# EAGLE design GasAlarm (EAGLE 8.4.0)
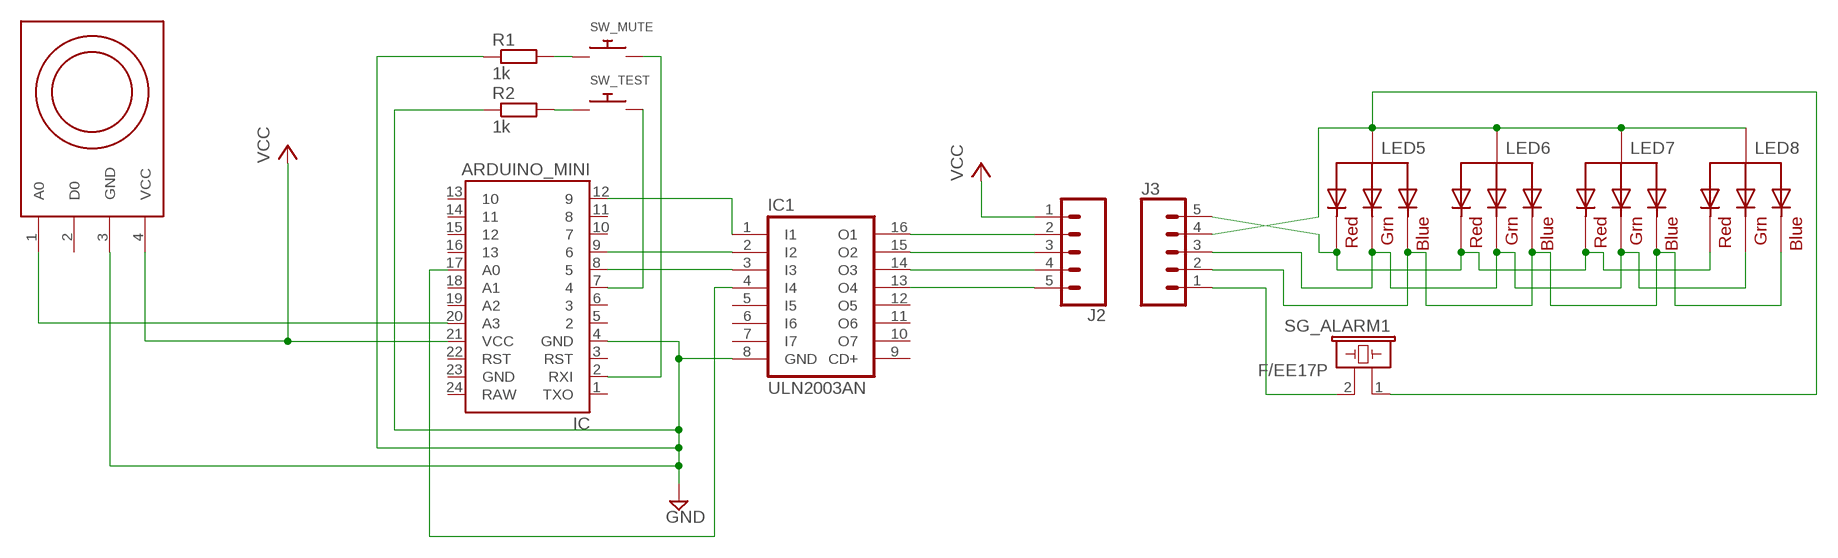
[diagram p0: schematic, sheet 1]

## Parts
IC  ARDUINO_MINI  [ARDUINO_MINI]
IC1  ULN2003AN  [DIL16]
J2  CONN_05  [1X05]
J3  CONN_05  [1X05]
LED5  RGBLED_CA-5MM  [LED5MMRGB]
LED6  RGBLED_CA-5MM  [LED5MMRGB]
LED7  RGBLED_CA-5MM  [LED5MMRGB]
LED8  RGBLED_CA-5MM  [LED5MMRGB]
MQ6  MQ-6  [DIP4-MQ_6]
R1  1k  R-EU_0204/5  [0204/5]
R2  1k  R-EU_0204/5  [0204/5]
SG_ALARM1  F/EE17P  [F/EE17P]
SW_MUTE  SWITCH_PUSHBUTTONSOFTTOUCHSMD_SJ  [PUSHBUTTON_SMD_SJ]
SW_TEST  SWITCH_PUSHBUTTONSOFTTOUCHSMD_SJ  [PUSHBUTTON_SMD_SJ]

## Nets
GND: IC1.8(GND) IC.4(GND) MQ6.3(GND) R1.1 R2.1
N$1: IC1.16(O1) J2.2
N$2: IC1.15(O2) J2.3
N$3: IC1.14(O3) J2.4
N$4: IC1.13(O4) J2.5
N$5: IC.7 SW_TEST.P$2
N$6: IC1.3(I3) IC.8
N$7: IC1.2(I2) IC.9
N$8: IC1.1(I1) IC.12
N$9: IC.2(RXI) SW_MUTE.P$2
N$10: R2.2 SW_TEST.P$1
N$11: R1.2 SW_MUTE.P$1
N$12: IC.20(A3) MQ6.1(A0)
N$14: IC1.4(I4) IC.17(A0)
N$19: J3.5 LED5.1(RED) LED6.1(RED) LED7.1(RED) LED8.1(RED)
N$20: J3.4 LED5.2(VCC) LED6.2(VCC) LED7.2(VCC) LED8.2(VCC) SG_ALARM1.1
N$21: J3.3 LED5.3(GREEN) LED6.3(GREEN) LED7.3(GREEN) LED8.3(GREEN)
N$22: J3.2 LED5.4(BLUE) LED6.4(BLUE) LED7.4(BLUE) LED8.4(BLUE)
N$23: J3.1 SG_ALARM1.2
VCC: IC.21(VCC) J2.1 MQ6.4(VCC)
Unconnected: IC1.5(I5) IC1.6(I6) IC1.7(I7) IC1.9(CD+) IC1.10(O7) IC1.11(O6) IC1.12(O5) IC.1(TXO) IC.3(RST) IC.5 IC.6 IC.10 IC.11 IC.13 IC.14 IC.15 IC.16 IC.18(A1) IC.19(A2) IC.22(RST) IC.23(GND) IC.24(RAW) MQ6.2(D0)

## Library data of the parts
IC = SparkFun-Retired:ARDUINO_MINI: Arduino Pro Mini footprint
IC1 = uln-udn:ULN2003A: DRIVER ARRAY
J2 J3 = SparkFun-Connectors:CONN_05: Multi connection point. Often used as Generic Header-pin footprint for 0.1 inch spaced/style header connections On any of the 0.1 inch spaced packages, you can populate with these: Break Away Headers - Straight <https://www.sparkfun.com/products/116> (PRT-00116) Break Away Male Headers - Right Angle <https://www.sparkfun.com/products/553> (PRT-00553) Female Headers <https://www.sparkfun.com/products/115> (PRT-00115) Break Away Headers - Machine Pin <https://www.sparkfun.com/products/117> (PRT-00117) Break Away Female Headers - Swiss Machine Pin <https://www.sparkfun.com/products/743> (PRT-00743) For SCREWTERMINALS and SPRING TERMINALS visit here: Screw Terimnals on SparkFun.com <https://www.sparkfun.com/search/results?term=Screw+Terminals> (5mm/3.5mm/2.54mm spacing) This device is also useful as a general connection point to wire up your design to another part of your project. Our various solder wires solder well into these plated through hole pads. Hook-Up Wire - Assortment (Stranded, 22 AWG) <https://www.sparkfun.com/products/11375> (PRT-11375) Hook-Up Wire - Assortment (Solid Core, 22 AWG) <https://www.sparkfun.com/products/11367> (PRT-11367) View the entire wire category on our website here <https://www.sparkfun.com/categories/141> Special notes: Molex polarized connector foot print use with SKU : PRT-08231 with associated crimp pins and housings. 1MM SMD Version SKU: PRT-10208
LED5-LED8 = adafruit:RGBLED_CA: RGB LED, common-anode 5MM Staggered pins 5mm Piranha package http://www.ladyada.net/library/pcb/eaglelibrary.html
MQ6 = GasAlarm:MQ-6
R1 R2 = resistor:R-EU_: RESISTOR, European symbol
SG_ALARM1 = buzzer:F/EE17P: BUZZER Source: Buerklin; OC_FARNELL: unknown; OC_NEWARK: unknown
SW_MUTE SW_TEST = adafruit:SWITCH_PUSHBUTTON: Buttons SOFTTOUCHSMD_SJ - Soft touch temporary push button (Super Junk Akihabara) Compatible with SKPMANE010 [Mouser: 688-SKPMAN] C&K_KSS = Digikey: KSS221GLFS

## Board
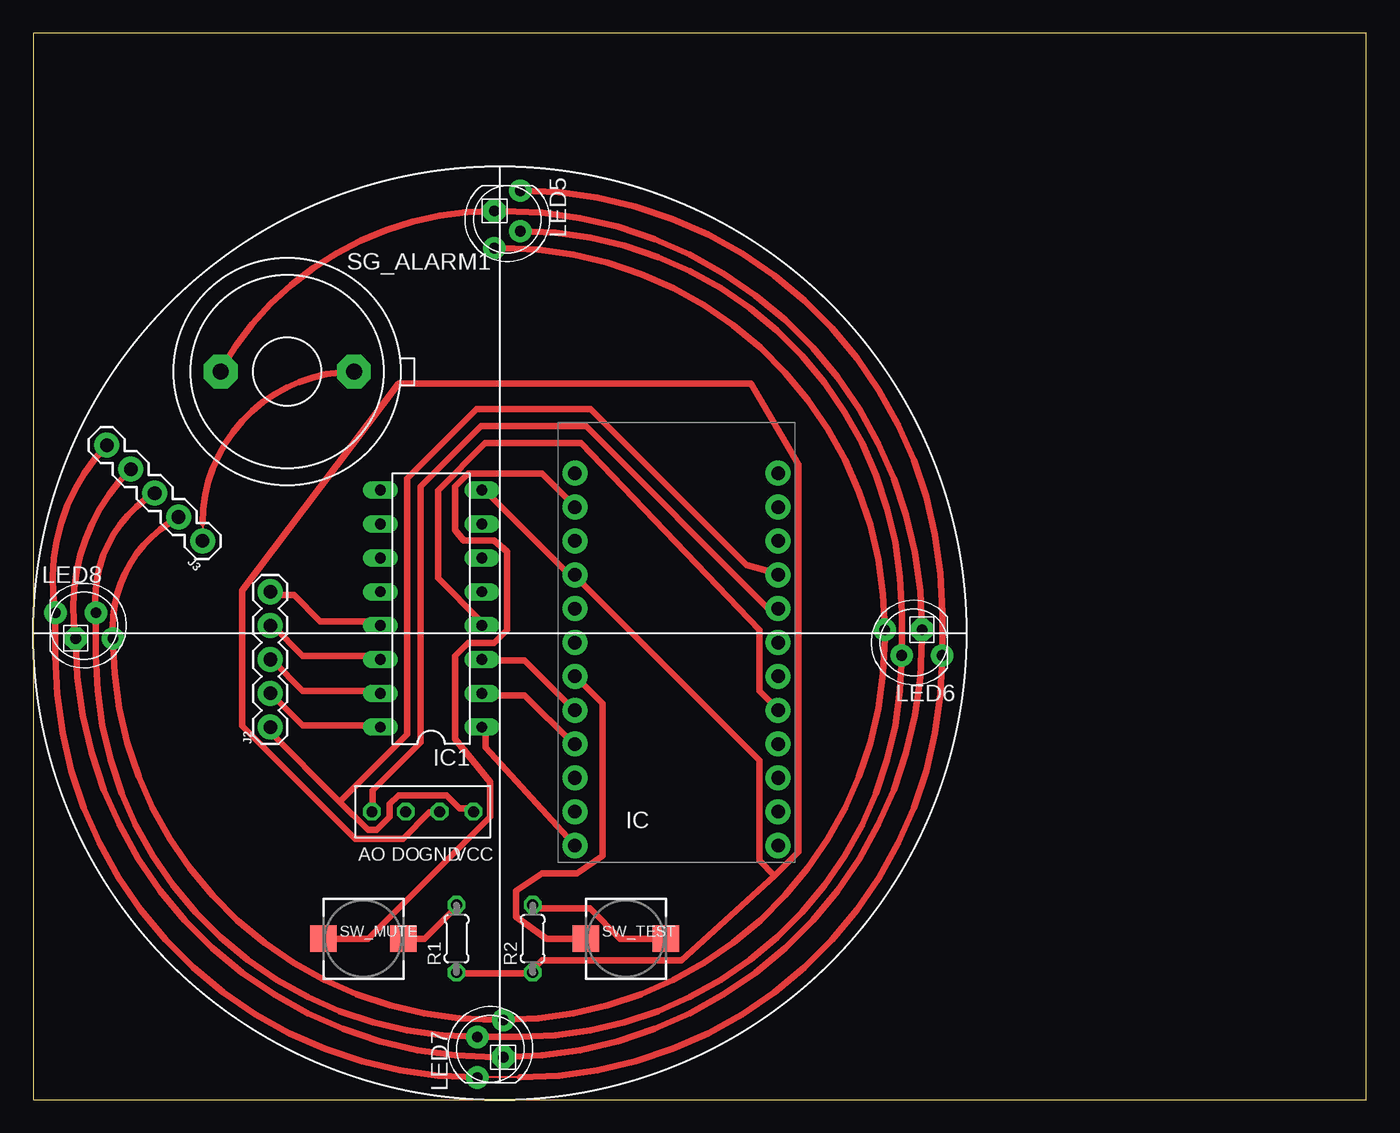
[diagram p1: board, top side]

Size 100 x 80 mm. Coordinates in mm from the lower left corner, seen from the top.
Outline: 0,0 100,0 100,80 0,80 0,0
Copper layers (1*16): Top 0.035mm / dielectric 1.5mm / Bottom 0.035mm
Design rules "default *": minimum track width 0.5mm, minimum drill 1mm, track to track 6mil, track to pad 6mil, pad to pad 6mil, via to via 6mil, smd to smd 6mil, copper to edge 40mil, drill to drill 6mil, minimum pad ring 10mil, minimum via ring 8mil, stop-mask expansion 4mil, vias tented up to drill 0mil, thermal gap 10mil

### Footprints (pad centres in the part's own frame; a part is rotated, then mirrored left to right if it is on the bottom)
ARDUINO_MINI = drill 1.016 pad 1.88: 1 -7.62,12.7; 2 -7.62,10.16; 3 -7.62,7.62; 4 -7.62,5.08; 5 -7.62,2.54; 6 -7.62,0; 7 -7.62,-2.54; 8 -7.62,-5.08; 9 -7.62,-7.62; 10 -7.62,-10.16; 11 -7.62,-12.7; 12 -7.62,-15.24; 13 7.62,-15.24; 14 7.62,-12.7; 15 7.62,-10.16; 16 7.62,-7.62; 17 7.62,-5.08; 18 7.62,-2.54; 19 7.62,0; 20 7.62,2.54; 21 7.62,5.08; 22 7.62,7.62; 23 7.62,10.16; 24 7.62,12.7
DIL16 = drill 0.813 long: 1 -8.89,-3.81; 2 -6.35,-3.81; 3 -3.81,-3.81; 4 -1.27,-3.81; 5 1.27,-3.81; 6 3.81,-3.81; 7 6.35,-3.81; 8 8.89,-3.81; 9 8.89,3.81; 10 6.35,3.81; 11 3.81,3.81; 12 1.27,3.81; 13 -1.27,3.81; 14 -3.81,3.81; 15 -6.35,3.81; 16 -8.89,3.81
1X05 = drill 1.016 pad 1.88: 1 0,0; 2 2.54,0; 3 5.08,0; 4 7.62,0; 5 10.16,0
LED5MMRGB = drill 0.8 pad 1.676: 1 -2.159,0.968; 3 0.889,0.968; 4 2.159,-0.968 | drill 0.8 pad 1.676 octagon: 2 -0.635,-0.968
DIP4-MQ_6 = drill 0.813 octagon: 1 -3.81,-0.635; 2 -1.27,-0.635; 3 1.27,-0.635; 4 3.81,-0.635
0204/5 = drill 0.813 octagon: 1 -2.54,0; 2 2.54,0
F/EE17P = drill 1.194 pad 2.54 octagon: 1 -5.004,0; 2 5.004,0
PUSHBUTTON_SMD_SJ = smd 2 x 2: P$1 3,0; P$2 -3,0

### Placement (x,y rotation side)
IC  48.26,34.29 0 top
IC1  29.84,36.83 90 top
J2  17.78,27.94 90 top
J3  12.7,41.91 135 top
LED5  35.56,66.04 270 top
LED6  66.04,34.29 180 top
LED7  34.29,3.81 90 top
LED8  3.81,35.56 0 top
MQ6  29.21,22.23 0 top
R1  31.75,12.06 90 top
R2  37.47,12.06 90 top
SG_ALARM1  19.05,54.61 0 top
SW_MUTE  24.77,12.06 0 top
SW_TEST  44.45,12.06 0 top

### Tracks (layer width: path | path; a pad name or v marks a point on that pad's centre or on a via)
GND
  Top 0.5: IC1.8 33.92,45.67 40.45,39.14 IC.4 40.77,39.14 54.48,25.44 54.48,17.94 55.62,16.8 | R1.1 31.97,9.46 37.19,9.46 R2.1 37.51,9.79 38.16,10.44 48.62,10.44 55.62,16.8 | 55.62,16.8 57.41,18.59 57.41,47.62 53.84,53.74 27.42,53.74 15.68,38.18 15.68,28.04 24.14,19.57 27.73,19.57 29.68,21.53 30.34,21.53 MQ6.3
N$1
  Top 0.5: IC1.16 25.77,28.05 20.22,28.05 17.94,30.34 J2.2
N$2
  Top 0.5: IC1.15 25.77,30.66 20.22,30.66 17.94,32.95 J2.3
N$3
  Top 0.5: IC1.14 25.77,33.27 20.22,33.27 17.94,35.56 J2.4
N$4
  Top 0.5: IC1.13 25.77,35.88 21.53,35.88 19.57,37.84 17.94,37.84 J2.5
N$5
  Top 0.5: SW_TEST.P$2 41.43,12.07 38.49,12.07 36.21,13.72 36.21,15.64 38.18,16.98 40.79,16.98 42.72,18.27 42.72,29.7 40.77,31.64 IC.7
N$6
  Top 0.5: IC1.3 33.92,32.95 36.86,32.95 40.45,29.36 IC.8
N$7
  Top 0.5: IC1.2 33.92,30.34 36.86,30.34 40.45,26.75 IC.9
N$8
  Top 0.5: IC1.1 33.92,27.73 33.92,26.41 40.45,19.25 IC.12
N$9
  Top 0.5: SW_MUTE.P$2 21.86,12.07 25.12,12.07 34.25,21.2 34.25,23.83 31.64,27.07 31.64,33.27 32.62,34.25 34.58,34.25 35.56,35.23 35.56,41.1 34.58,41.95 32.29,41.95 31.64,42.73 31.64,45.99 32.62,46.97 38.16,46.97 40.45,44.69 IC.2
N$10
  Top 0.5: SW_TEST.P$1 47.3,12.07 44.04,12.07 41.75,14.35 37.51,14.35 R2.2
N$11
  Top 0.5: SW_MUTE.P$1 28.05,12.07 29.36,12.07 31.64,14.35 R1.2
N$12
  Top 0.5: MQ6.1 25.44,21.86 25.44,23.18 29.07,26.8 29.07,46.01 33.58,50.53 41.46,50.53 55.13,36.86 55.78,36.86 IC.20
N$14
  Top 0.5: IC1.4 33.6,35.88 30.35,39.13 30.35,45.69 33.91,49.24 41.1,49.24 54.48,35.23 54.48,30.66 55.78,29.36 IC.17
N$19
  Top 0.152: 36.53,1.65 LED7.1
  Top 0.5: LED5.1 arc-90 68.2,36.53 LED6.1 arc-90 36.53,1.65 | LED7.1 arc-90 1.65,33.32 LED8.1 arc-54 J3.5
N$20
  Top 0.152: 35.26,66.67 LED5.2 | LED6.2 66.67,34.59 | LED7.2 34.59,3.17
  Top 0.5: 35.26,66.67 arc-90 LED6.2 | 66.67,34.59 arc-90 LED7.2 | 34.59,3.17 arc-90 LED8.2 arc-54 J3.4 | LED5.2 arc60 14.07,54.78 | 14.07,54.78 arc0 13.97,54.61 | SG_ALARM1.1 14.03,54.8 14.07,54.78
N$21
  Top 0.5: LED5.3 arc-90 65.15,36.53 LED6.3 arc-90 36.53,4.7 LED7.3 arc-90 4.7,33.32 LED8.3 arc-64 J3.3
N$22
  Top 0.152: LED5.4 35.26,63.88 | LED6.4 63.88,34.59 | LED7.4 34.59,5.97
  Top 0.5: 35.26,63.88 arc-90 LED6.4 | 63.88,34.59 arc-90 LED7.4 | 34.59,5.97 arc-90 LED8.4 arc-66 J3.2
N$23
  Top 0.152: 12.7,43.26 J3.1
  Top 0.5: SG_ALARM1.2 arc90 12.7,43.26
VCC
  Top 0.5: 23,22.34 17.61,27.73 J2.1 | 23,22.34 25.12,20.22 25.77,20.22 26.75,21.2 26.75,22.18 27.4,22.83 30.99,22.83 31.97,21.86 32.95,21.86 MQ6.4 | 23,22.34 28.05,27.4 28.05,46.61 33.26,51.81 41.79,51.81 53.5,40.1 55.78,39.47 IC.21